# EAGLE schematic RP2350 (EAGLE 9.6.2)
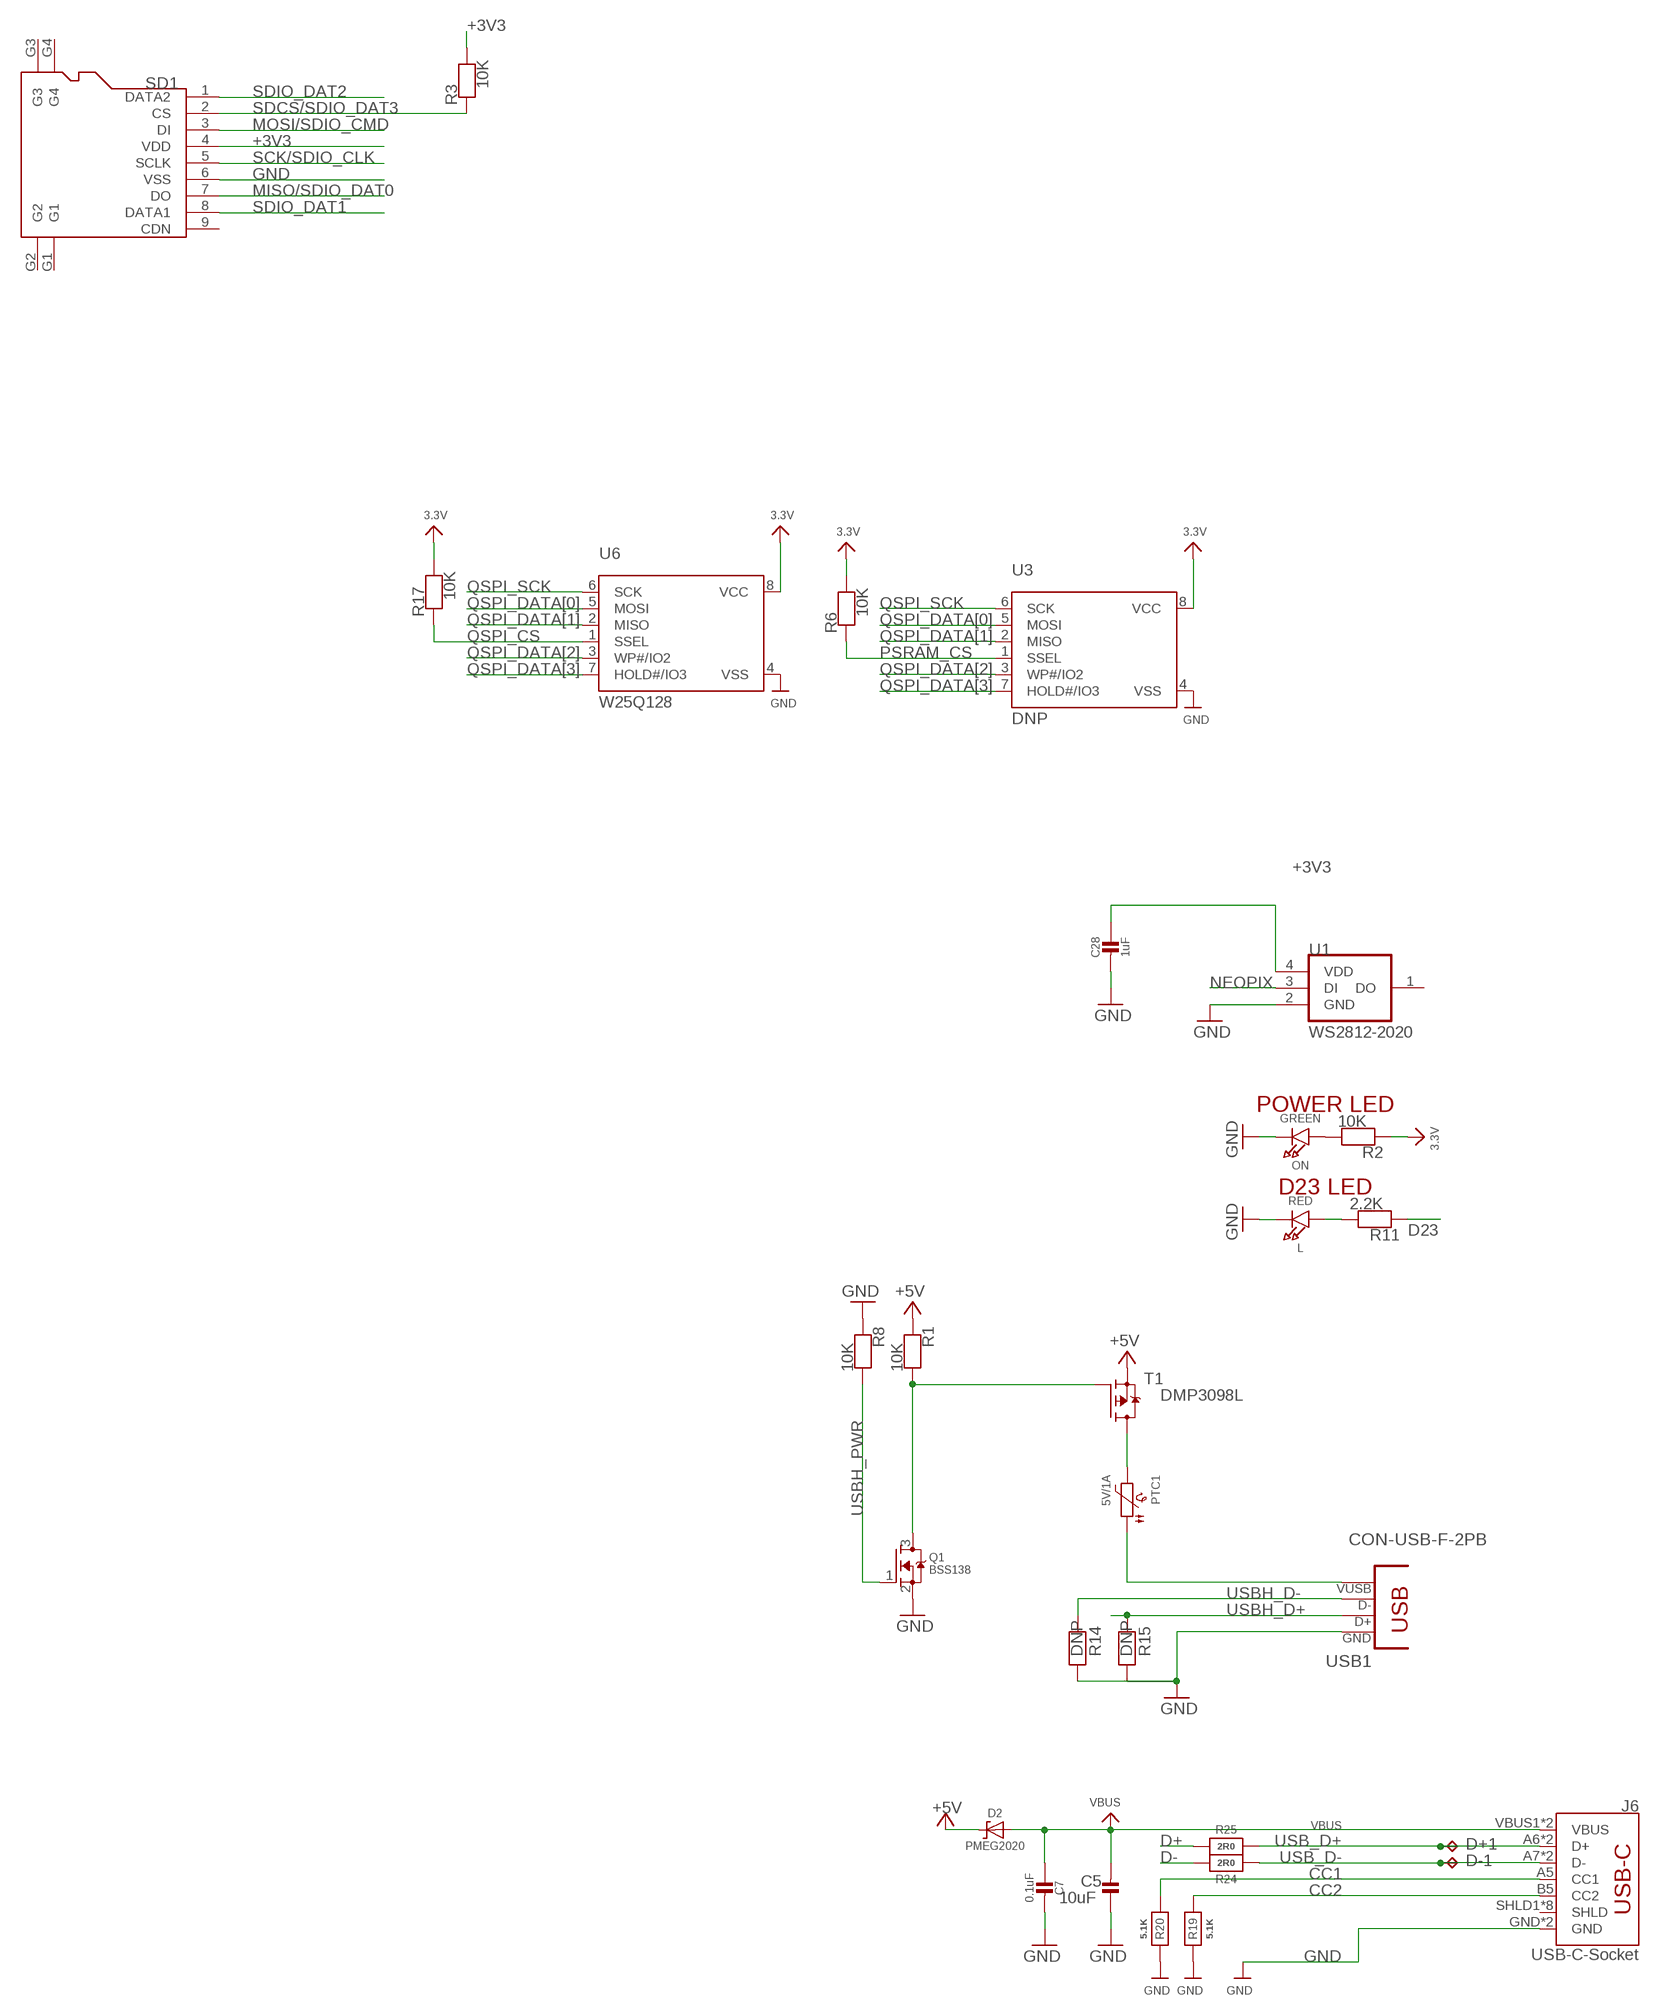
[diagram p0: schematic, sheet 1, part 1 of 2]
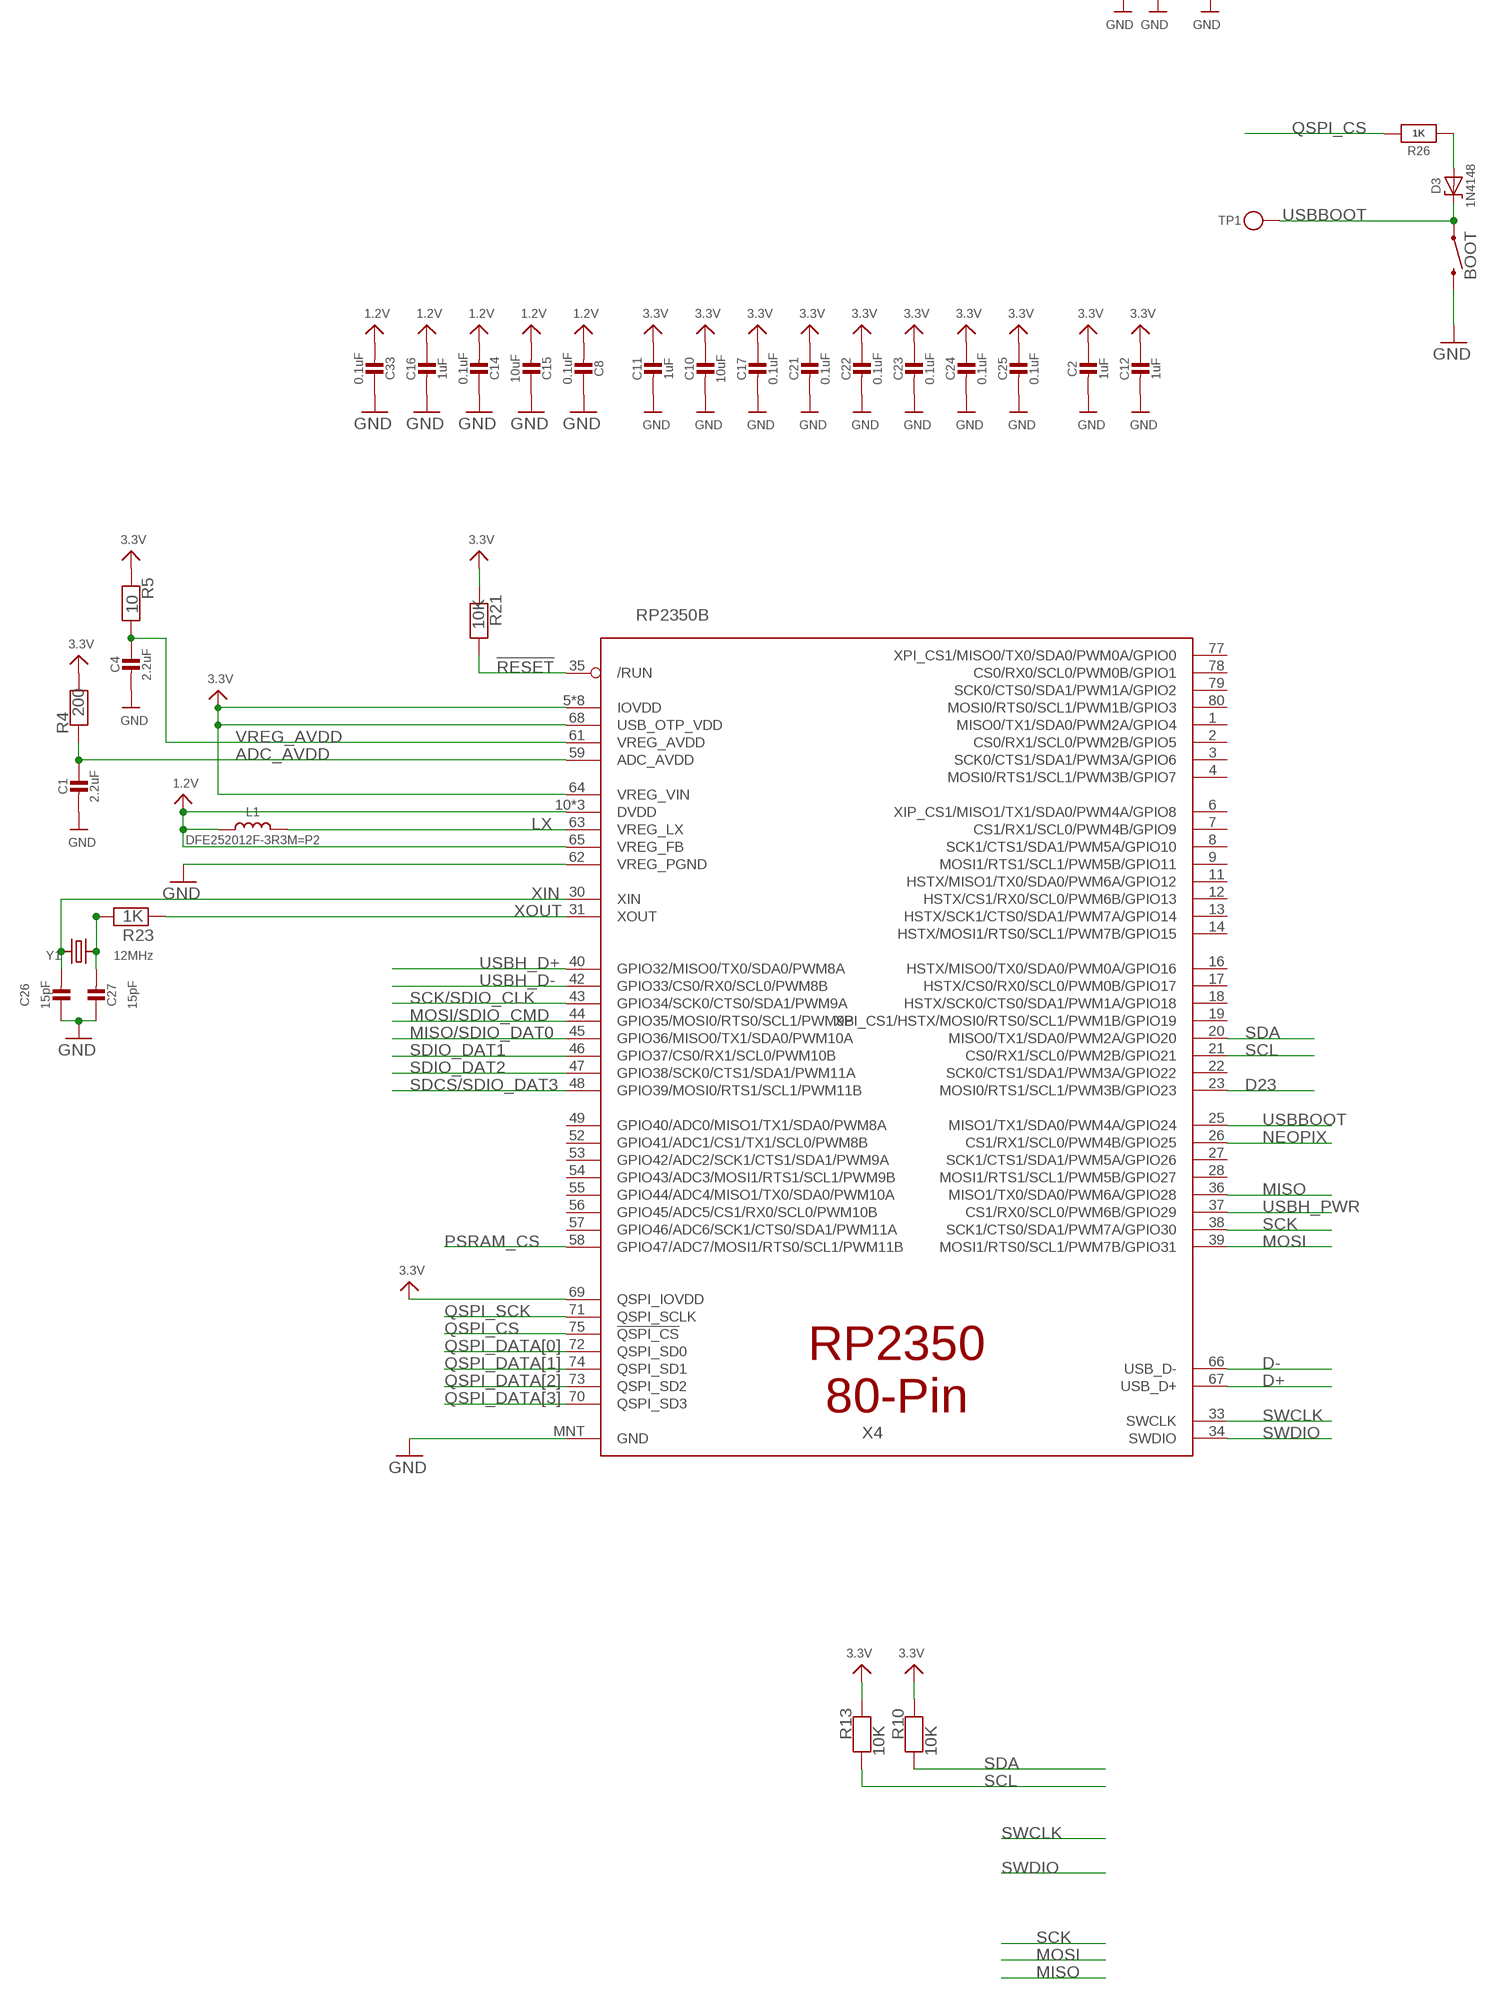
[diagram p1: schematic, sheet 1, part 2 of 2]

## Parts
BOOT  MOMENTARY-SWITCH-SPST-SMD-6.0X3.5MM  [TACTILE_SWITCH_SMD_6.0X3.5MM]
C1  2.2uF  CAP_CERAMIC0603_NO  [0603-NO]
C2  1uF  CAP_CERAMIC0603_NO  [0603-NO]
C4  2.2uF  CAP_CERAMIC0603_NO  [0603-NO]
C5  10uF  CAP_CERAMIC0805-NOOUTLINE  [0805-NO]
C7  0.1uF  CAP_CERAMIC0603_NO  [0603-NO]
C8  0.1uF  CAP_CERAMIC0603_NO  [0603-NO]
C10  10uF  CAP_CERAMIC_0603WIDE  [0603-NO_WIDE]
C11  1uF  CAP_CERAMIC0603_NO  [0603-NO]
C12  1uF  CAP_CERAMIC0603_NO  [0603-NO]
C14  0.1uF  CAP_CERAMIC0603_NO  [0603-NO]
C15  10uF  CAP_CERAMIC_0603WIDE  [0603-NO_WIDE]
C16  1uF  CAP_CERAMIC0603_NO  [0603-NO]
C17  0.1uF  CAP_CERAMIC0603_NO  [0603-NO]
C21  0.1uF  CAP_CERAMIC0603_NO  [0603-NO]
C22  0.1uF  CAP_CERAMIC0603_NO  [0603-NO]
C23  0.1uF  CAP_CERAMIC0603_NO  [0603-NO]
C24  0.1uF  CAP_CERAMIC0603_NO  [0603-NO]
C25  0.1uF  CAP_CERAMIC0603_NO  [0603-NO]
C26  15pF  CAP_CERAMIC0603_NO  [0603-NO]
C27  15pF  CAP_CERAMIC0603_NO  [0603-NO]
C28  1uF  CAP_CERAMIC0603_NO  [0603-NO]
C33  0.1uF  CAP_CERAMIC0603_NO  [0603-NO]
D2  PMEG2020  DIODE-SCHOTTKYSOD-323  [SOD-323]
D3  1N4148  DIODE-SCHOTTKYSOD-323  [SOD-323]
D+1  TPB1,27  [B1,27]
D-1  TPB1,27  [B1,27]
J6  USB-C-Socket  USB_C16PIN  [USB-C-16P]
L  RED  LED0603_NOOUTLINE  [CHIPLED_0603_NOOUTLINE]
L1  DFE252012F-3R3M=P2  INDUCTOR  [INDUCTOR_1007]
ON  GREEN  LED0603_NOOUTLINE  [CHIPLED_0603_NOOUTLINE]
PTC1  5V/1A  PTC_0805  [0805-NO]
Q1  BSS138  MOSFET-NWIDE  [SOT23-WIDE]
R1  10K  RESISTOR_0603_NOOUT  [0603-NO]
R2  10K  RESISTOR_0603_NOOUT  [0603-NO]
R3  10K  RESISTOR_0603_NOOUT  [0603-NO]
R4  200  RESISTOR_0603_NOOUT  [0603-NO]
R5  10  RESISTOR_0603_NOOUT  [0603-NO]
R6  10K  RESISTOR_0603_NOOUT  [0603-NO]
R8  10K  RESISTOR_0603_NOOUT  [0603-NO]
R10  10K  RESISTOR_0603_NOOUT  [0603-NO]
R11  2.2K  RESISTOR_0603_NOOUT  [0603-NO]
R13  10K  RESISTOR_0603_NOOUT  [0603-NO]
R14  DNP  RESISTOR_0603_NOOUT  [0603-NO]
R15  DNP  RESISTOR_0603_NOOUT  [0603-NO]
R17  10K  RESISTOR_0603_NOOUT  [0603-NO]
R19  5.1K  RESISTOR_0603_NOOUT  [0603-NO]
R20  5.1K  RESISTOR_0603_NOOUT  [0603-NO]
R21  10K  RESISTOR_0603_NOOUT  [0603-NO]
R23  1K  RESISTOR_0603_NOOUT  [0603-NO]
R24  2R0  RESISTOR_0603_NOOUT  [0603-NO]
R25  2R0  RESISTOR_0603_NOOUT  [0603-NO]
R26  1K  RESISTOR_0603_NOOUT  [0603-NO]
SD1  HOLDER-MICROSD-9P  [9P-SMD-W/-RING]
T1  DMP3098L  MOSFET-PWIDE  [SOT23-WIDE]
TP1  TESTPOINTROUND1.5MMNO  [TESTPOINT_ROUND_1.5MM_NO]
U1  WS2812-2020  [LED_WS2812-2020]
U3  DNP  SPIFLASH_8PIN208MIL  [SOIC8_208MIL]
U6  W25Q128  SPIFLASH_8PIN208MIL  [SOIC8_208MIL]
USB1  CON-USB-F-2PB  [CONN_USB_A_F]
X4  RP2350B  [QFN80]
Y1  12MHz  CRYSTAL2.5X2.0  [CRYSTAL_2.5X2]

## Nets
1.2V: C8.2 C14.2 C15.2 C16.1 C33.2 L1.P$1 X4.10(DVDD) X4.32(DVDD) X4.51(DVDD) X4.65(VREG_FB)
!RESET: R21.2 X4.35(/RUN)
+3V3: C2.1 C10.1 C11.1 C12.1 C17.1 C21.1 C22.1 C23.1 C24.1 C25.1 C28.1 R2.1 R3.2 R4.2 R5.1 R6.2 R10.1 R13.1 R17.2 R21.1 SD1.4(VDD) U1.4(VDD) U3.8(VCC) U6.8(VCC) X4.5(IOVDD) X4.15(IOVDD) X4.24(IOVDD) X4.29(IOVDD) X4.41(IOVDD) X4.50(IOVDD) X4.60(IOVDD) X4.64(VREG_VIN) X4.68(USB_OTP_VDD) X4.69(QSPI_IOVDD) X4.76(IOVDD) ; supply symbol labelled 3.3V
+5V [HIGHPOWER]: D2.C R1.1 T1.2(S)
ADC_AVDD: C1.1 R4.1 X4.59(ADC_AVDD)
CC1: J6.A5(CC1) R20.2
CC2: J6.B5(CC2) R19.2
D23: R11.1 X4.23(MOSI0/RTS1/SCL1/PWM3B/GPIO23)
D+: R25.2 X4.67(USB_D+)
D-: R24.2 X4.66(USB_D-)
GND: BOOT.2 C1.2 C2.2 C4.2 C5.1 C7.2 C8.1 C10.2 C11.2 C12.2 C14.1 C15.1 C16.2 C17.2 C21.2 C22.2 C23.2 C24.2 C25.2 C26.1 C27.1 C28.2 C33.1 J6.GND J6.GND2(GND) L.C ON.C Q1.2(S) R8.1 R14.1 R15.1 R19.1 R20.1 SD1.6(VSS) U1.2(GND) U3.4(VSS) U6.4(VSS) USB1.4(GND) X4.62(VREG_PGND) X4.MNT(GND)
LX: L1.P$2 X4.63(VREG_LX)
MISO: X4.36(MISO1/TX0/SDA0/PWM6A/GPIO28)
MISO/SDIO_DAT0: SD1.7(DO) X4.45(GPIO36/MISO0/TX1/SDA0/PWM10A)
MOSI: X4.39(MOSI1/RTS0/SCL1/PWM7B/GPIO31)
MOSI/SDIO_CMD: SD1.3(DI) X4.44(GPIO35/MOSI0/RTS0/SCL1/PWM9B)
N$1: L.A R11.2
N$2: ON.A R2.2
N$3: PTC1.1 USB1.1(VUSB)
N$4: PTC1.2 T1.3(D)
N$5: Q1.3(D) R1.2 T1.1(G)
N$6: D3.A R26.2
N$10: C27.2 R23.1 Y1.3
NEOPIX: U1.3(DI) X4.26(CS1/RX1/SCL0/PWM4B/GPIO25)
PSRAM_CS: R6.1 U3.1(SSEL) X4.58(GPIO47/ADC7/MOSI1/RTS0/SCL1/PWM11B)
QSPI_CS: R17.1 R26.1 U6.1(SSEL) X4.75(!QSPI_CS)
QSPI_DATA[0]: U3.5(MOSI) U6.5(MOSI) X4.72(QSPI_SD0)
QSPI_DATA[1]: U3.2(MISO) U6.2(MISO) X4.74(QSPI_SD1)
QSPI_DATA[2]: U3.3(WP#/IO2) U6.3(WP#/IO2) X4.73(QSPI_SD2)
QSPI_DATA[3]: U3.7(HOLD#/IO3) U6.7(HOLD#/IO3) X4.70(QSPI_SD3)
QSPI_SCK: U3.6(SCK) U6.6(SCK) X4.71(QSPI_SCLK)
SCK: X4.38(SCK1/CTS0/SDA1/PWM7A/GPIO30)
SCK/SDIO_CLK: SD1.5(SCLK) X4.43(GPIO34/SCK0/CTS0/SDA1/PWM9A)
SCL: R13.2 X4.21(CS0/RX1/SCL0/PWM2B/GPIO21)
SDA: R10.2 X4.20(MISO0/TX1/SDA0/PWM2A/GPIO20)
SDCS/SDIO_DAT3: R3.1 SD1.2(CS) X4.48(GPIO39/MOSI0/RTS1/SCL1/PWM11B)
SDIO_DAT1: SD1.8(DATA1) X4.46(GPIO37/CS0/RX1/SCL0/PWM10B)
SDIO_DAT2: SD1.1(DATA2) X4.47(GPIO38/SCK0/CTS1/SDA1/PWM11A)
SWCLK: X4.33(SWCLK)
SWDIO: X4.34(SWDIO)
USB_D+: D+1.TP J6.A6(D+) J6.B6(D+) R25.1
USB_D-: D-1.TP J6.A7(D-) J6.B7(D-) R24.1
USBBOOT: BOOT.1 D3.C TP1.P$1 X4.25(MISO1/TX1/SDA0/PWM4A/GPIO24)
USBH_D+: R15.2 USB1.3(D+) X4.40(GPIO32/MISO0/TX0/SDA0/PWM8A)
USBH_D-: R14.2 USB1.2(D-) X4.42(GPIO33/CS0/RX0/SCL0/PWM8B)
USBH_PWR: Q1.1(G) R8.2 X4.37(CS1/RX0/SCL0/PWM6B/GPIO29)
VBUS [HIGHPOWER]: C5.2 C7.1 D2.A J6.VBUS1(VBUS) J6.VBUS2(VBUS)
VREG_AVDD: C4.1 R5.2 X4.61(VREG_AVDD)
XIN: C26.2 X4.30(XIN) Y1.1
XOUT: R23.2 X4.31(XOUT)
Unconnected: J6.SHLD1(SHLD) J6.SHLD2(SHLD) J6.SHLD3(SHLD) J6.SHLD4(SHLD) J6.SHLD5(SHLD) J6.SHLD6(SHLD) J6.SHLD7(SHLD) J6.SHLD8(SHLD) SD1.9(CDN) SD1.G1 SD1.G2 SD1.G3 SD1.G4 U1.1(DO) USB1.B1(BODY) USB1.B2(BODY) X4.1(MISO0/TX1/SDA0/PWM2A/GPIO4) X4.2(CS0/RX1/SCL0/PWM2B/GPIO5) X4.3(SCK0/CTS1/SDA1/PWM3A/GPIO6) X4.4(MOSI0/RTS1/SCL1/PWM3B/GPIO7) X4.6(XIP_CS1/MISO1/TX1/SDA0/PWM4A/GPIO8) X4.7(CS1/RX1/SCL0/PWM4B/GPIO9) X4.8(SCK1/CTS1/SDA1/PWM5A/GPIO10) X4.9(MOSI1/RTS1/SCL1/PWM5B/GPIO11) X4.11(HSTX/MISO1/TX0/SDA0/PWM6A/GPIO12) X4.12(HSTX/CS1/RX0/SCL0/PWM6B/GPIO13) X4.13(HSTX/SCK1/CTS0/SDA1/PWM7A/GPIO14) X4.14(HSTX/MOSI1/RTS0/SCL1/PWM7B/GPIO15) X4.16(HSTX/MISO0/TX0/SDA0/PWM0A/GPIO16) X4.17(HSTX/CS0/RX0/SCL0/PWM0B/GPIO17) X4.18(HSTX/SCK0/CTS0/SDA1/PWM1A/GPIO18) X4.19(XPI_CS1/HSTX/MOSI0/RTS0/SCL1/PWM1B/GPIO19) X4.22(SCK0/CTS1/SDA1/PWM3A/GPIO22) X4.27(SCK1/CTS1/SDA1/PWM5A/GPIO26) X4.28(MOSI1/RTS1/SCL1/PWM5B/GPIO27) X4.49(GPIO40/ADC0/MISO1/TX1/SDA0/PWM8A) X4.52(GPIO41/ADC1/CS1/TX1/SCL0/PWM8B) X4.53(GPIO42/ADC2/SCK1/CTS1/SDA1/PWM9A) X4.54(GPIO43/ADC3/MOSI1/RTS1/SCL1/PWM9B) X4.55(GPIO44/ADC4/MISO1/TX0/SDA0/PWM10A) X4.56(GPIO45/ADC5/CS1/RX0/SCL0/PWM10B) X4.57(GPIO46/ADC6/SCK1/CTS0/SDA1/PWM11A) X4.77(XPI_CS1/MISO0/TX0/SDA0/PWM0A/GPIO0) X4.78(CS0/RX0/SCL0/PWM0B/GPIO1) X4.79(SCK0/CTS0/SDA1/PWM1A/GPIO2) X4.80(MOSI0/RTS0/SCL1/PWM1B/GPIO3)

## Notes on the sheet
- POWER LED
- D23 LED

## Library data of the parts
BOOT = SparkFun-Switches:MOMENTARY-SWITCH-SPST: Momentary Switch (Pushbutton) - SPST Normally-open (NO) SPST momentary switches (buttons, pushbuttons). Variants PTH-12MM - 12mm square, through-hole Momentary Pushbutton Switch - 12mm Square <https://www.sparkfun.com/products/9190> (COM-09190) PTH-6.0MM, PTH-6.0MM-KIT - 6.0mm square, through-hole Mini Pushbutton Switch <https://www.sparkfun.com/products/97> (COM-00097) KIT package intended for soldering kit's - only one side of pads' copper is exposed. PTH-RIGHT-ANGLE-KIT - Right-angle, through-hole Right Angle Tactile Button <https://www.sparkfun.com/products/10791> - Used on SparkFun BigTime Watch Kit <https://www.sparkfun.com/products/11734> SMD-12MM - 12mm square, surface-mount Tactile Button - SMD (12mm) <https://www.sparkfun.com/products/12993> (COM-12993) Used on SparkFun PicoBoard <https://www.sparkfun.com/products/11888> SMD-4.5MM - 4.5mm Square Trackball Switch Used on SparkFun Blackberry Trackballer Breakout <https://www.sparkfun.com/products/13169> SMD-4.6MMX2.8MM - 4.60mm x 2.80mm, surface mount Used on SparkFun Pro Micro - RP2040 <https://www.sparkfun.com/products/17717> SMD-5.2MM, SMD-5.2-REDUNDANT - 5.2mm square, surface-mount Mini Pushbutton Switch - SMD <https://www.sparkfun.com/products/8720> (COM-08720) Used on Arduino Pro Mini <https://www.sparkfun.com/products/11114> REDUNDANT package connects both switch circuits together SMD-6.0X3.5MM - 6.0 x 3.5mm, surface mount Momentary Reset Switch SMD <https://www.sparkfun.com/products/8229> (COM-08229) SMD-6.2MM-TALL - 6.2mm square, surface mount Tactile Button - SMD (6mm) <https://www.sparkfun.com/products/12992> Used on SparkFun Digital Sandbox <https://www.sparkfun.com/products/12651> SMD-RIGHT-ANGLE - Right-angle, surface mount Used on SparkFun Block for Intel® Edison - Arduino <https://www.sparkfun.com/products/13036>; PROD_ID: SWCH-14278; SF_SKU: COM-08229
C1 C2 C4 C5 C7 C8 C10-C12 C14-C17 C21-C28 C33 = microbuilder:CAP_CERAMIC: Ceramic Capacitors For new designs, use the packages preceded by an '_' character since they are more reliable: The following footprints should be used on most boards: _0402 - Standard footprint for regular board layouts _0603 - Standard footprint for regular board layouts _0805 - Standard footprint for regular board layouts _1206 - Standard footprint for regular board layouts For extremely tight-pitch boards where space is at a premium, the following 'micro-pitch' footprints can be used (smaller pads, no silkscreen outline, etc.): _0402MP - Micro-pitch footprint for very dense/compact boards _0603MP - Micro-pitch footprint for very dense/compact boards _0805MP - Micro-pitch footprint for very dense/compact boards _1206MP - Micro-pitch footprint for very dense/compact boards
D2 D3 = microbuilder:DIODE-SCHOTTKY
D+1 D-1 = testpad:TP: Test pad
J6 = SparkFun-Connectors:USB_C: USB Type C 16Pin Connector Super Speed pins not available on the 16-pin purely SMD connector so this part is best for USB 2.0 implementations. D1 and D2 are tied together enabling D+/- no matter which way the cable is plugged into the connector. The two channel configuration pins (CC1/2) are exposed. These are normally connected to ground via 5.1k resistors but can be reconfigured for high current/high power applications.; PROD_ID: CONN-14122
L ON = microbuilder:LED: LED 0603 - 0603 Surface Mount Package 2mA: Green LED - Low Power (3.9mcd, 2ma, 1.7Vf) - Digikey: 475-2709-2-ND Orange LED - Low Power (9.8mcd, 2ma, 1.8Vf) - Digikey: 475-1194-2-ND Red LED - Low Power (5mcd, 2ma, 1.8Vf) - Digikey: 475-1195-2-ND Yellow LED - Low Power (7mcd, 2ma, 1.8Vf) - Digikey: 475-1196-2-ND 5mA: Blue LED - Low Power (17mcd, 5ma, 2.9Vf) - Digikey: LNJ937W8CRACT-ND 0805 - 0805 Surface Mount Package 2mA: Red LED (8.8mcd, 2mA, 1.8Vf, Clear) - Low Power [Digikey: 475-2510-1-ND] Green LED (5mcd, 2mA, 1.8Vf, Clear) - Low Power [Digikey: 475-2730-1-ND] Yellow LED (11.3mcd, 2mA, 1.8Vf, Clear) - Low Power [Digikey: 475-2555-1-ND] 20mA: Red LED (104mcd, 20mA, Diffused) - LS R976 [Digikey: 475-1278-6-ND] Red LED (12mcd, 20mA, 2.0Vf, Clear) - APT2012EC [Digikey: 754-1128-1-ND] Green LED (15mcd, 20mA, 2.2Vf, Clear) - APT2012GC [Digikey: 754-1131-1-ND] Orange LED (160mcd, 20mA, 2.1Vf, Clear) - APT2012SECK [Digikey: 754-1130-1-ND] 1206 - 1206 Surface Mount Package Green LED (26mcd, 20mA, Diffused) - LG N971 [Digikey: 475-1407-6-ND] Red LED (15mcd, 20mA, Diffused) - LH N974 [Digikey: 475-1416-6-ND] Cree - Cree High-Power Surface Mount LEDs XPEBWT-L1-0000-00D50 - White 111lm 350mA 2.9Vf 6200K 110° XTEAWT-00-0000-00000LEE3 - White 114lm 350mA 2.85Vf 5000K 115° Everlight - Everlight 45-21 Series Surface Mount LEDs 45-21/QK2C-B2832AC2CB2/2T - Warm White 2000mcd 20mA 3.25Vf 3050K 120° 45-21/LK2C-B38452C4CB2/2T - Nuetral White 2000mcd 20mA 3.25Vf 4150K 120° 45-21/LK2C-B50634C6CB2/2T - Cold White 2200mcd 20mA 3.25Vf 5650K 120° PLCC2 Reverse Mount LS T77K-J1L2-1-0-2-R18-Z - Red 11.25mcd 2mA 1.8Vf 630nm 120° LO T77K-L1M2-24-Z - Orange 19.6mcd 2mA 1.8Vf 606nm 120° LY T77K-K2M1-26-Z - Yellow 15.7mcd 2mA 1.8Vf 587nm 120°; ROT: 270
L1 = microbuilder:INDUCTOR: Inductors 0603: 10nH Ceramic Inductor - microwire antenna/RF (Digikey: 712-1434-2-ND) 0805: 560nH Ceramic Inductor - RF (Digikey: 553-1047-1-ND) 270nH Ceramic Inductor - Q = 40@250MHz, +-5%, 1 Ohm DC Resistance (Digikey: 535-10506-2-ND) 1007 (2518 Metric) SMT: 10µH 10% 250mOhm 820mA 1007 Inductor (Digikey: 587-2189-1-ND) 22µH 10% 500mOhm 580mA 1007 Inductor (Digikey: 587-2190-1-ND) 47µH 10% 950mOhm 420mA 1007 Inductor (Digikey: 587-2191-1-ND) 47µH 5% 100mOhm 1A 1008 Inductor (Digikey: 732-1816-1-ND) 5.0x5.0mm (Taiyo Yuden NR5040 Series) 6.8µH 20% 2.3A 64mOhm Inductor (Digikey: 587-2374-2-ND) 5.0x5.0mm (TDK VLC5045 Series) 4.7µH 20% 3.3A 34mOhm Inductor (Digikey: 445-6526-1-ND) 6.8µH 20% 2.7A 46mOhm Inductor (Digikey: 445-6527-1-ND) 6.0x6.0mm (TDK VLC6045 Series) 4.7µH 20% 3.8A 27mOhm Inductor (Digikey: 445-6538-2-ND) 6.8µH 20% 3A 41mOhm Inductor (Digikey: 445-6540-1-ND) 6.2µH 30% 2.2A 45mOhm Inductor (Digikey: SRR5028-6R2YCT-ND) - Not TDK VLC6045 but footprint should match 6.0x6.0mm (TDK SLF6045 Series) 6.8uH 30% 2A 33mOhm Inductor (Digikey: 445-4572-1-ND, Mouser: 810-SLF645T6R8N2R0PF) 6.0x6.0mm (Sumida CDRH5D28 Series) 6.2uH 30% 1.8A 45mOhm Inductor (Digikey: 308-1542-1-ND) Taiyo Yuden NR3015T2R2M - 2.2uH 20% 1.5A (Digikey: 587-1648-2-ND, Mouser: 963-NR3015T2R2M) - Used with TI TPS62172 CoilCraft RFID Transponder Coil - MA5532-AE (For use with AS3935 Lightning Sensor) Taiyo Yuden NRH2412T2R2MNGH - 2.2uH 20% 1AA (Digikey: 587-3443-1-ND) - Used with TI LM3671 Vishay IHLP 1.0uH Molded Inductor - 24mOhm DCR, 5A, +/-20%, -55°C-125°C (Digikey: 541-1319-1-ND)
PTC1 = microbuilder:PTC: PTC (Resettable Fuse) 1206 Package 250mA PTC (16V Max, Time-to-Trip: 0.08s) - Digikey: F2110CT-ND 1210 Package 100mA PTC (30V Max, Time-to-Trip: 0.6s) - Digikey: MF-USMF010-2CT-ND 1812 Package 750mA PTC (24V Max, Time-to-Trip: 0.2s) - Digikey: MF-MSMF075/24-2CT-ND
Q1 = microbuilder:MOSFET-N: N-Channel Mosfet LEGEND VDS: Voltage Drain-Source ID: Drain Current RDS(ON): Drain-Source On-State Resistance VGS(TH): Gate-Source Threshold Voltage CISS: Drain-Source Input Capacitance SOT-23 Name VDS ID RDS(ON) VGS(TH) CISS Order Number 2N7002E 60V 260mA 2.5 Ohm 2.5V @ 250uA 26.7pF @ 25V 2N7002ET1GOSTR-ND BSH103 30V 850mA 400 mOhm 400mV @ 1mA 83pF @ 24V BSH103,235-ND BSS138 60V 320mA 1.6 Ohm 1.5V @ 250uA 50pF @ 10V Mouser: 771-BSS138PW115 DMN2075U-7 20V 4.2A 38 mOhm 1V @ 250 uA 594.3pF @ 10V DMN2075U-7DICT-ND * BSS138 good choice for I2C level-shifting POWERPAK 1212-8 Name VDS ID RDS(ON) VGS(TH) CISS Order Number Si7308DN 60V 6A 58 mOhm 3V @ 250uA 665pF @ 15V SI7308DN-T1-E3CT-ND
R1-R6 R8 R10 R11 R13-R15 R17 R19-R21 R23-R26 = microbuilder:RESISTOR: Resistors For new designs, use the packages preceded by an '_' character since they are more reliable: The following footprints should be used on most boards: _0402 - Standard footprint for regular board layouts _0603 - Standard footprint for regular board layouts _0805 - Standard footprint for regular board layouts _1206 - Standard footprint for regular board layouts For extremely tight-pitch boards where space is at a premium, the following 'micro-pitch' footprints can be used (smaller pads, no silkscreen outline, etc.): _0402MP - Micro-pitch footprint for very dense/compact boards _0603MP - Micro-pitch footprint for very dense/compact boards _0805MP - Micro-pitch footprint for very dense/compact boards _1206MP - Micro-pitch footprint for very dense/compact boards
SD1 = Connector:HOLDER-MICROSD-9P
T1 = microbuilder:MOSFET-P: P-Channel Mosfet LEGEND VDS: Voltage Drain-Source ID: Drain Current RDS(ON): Drain-Source On-State Resistance VGS(TH): Gate-Source Threshold Voltage CISS: Drain-Source Input Capacitance SOT-23 Name VDS ID RDS(ON) VGS(TH) CISS Order Number IRLML5103 30V 760mA 600 mOhm -- 75pF @ 25V Digikey: IRLML5103PBFCT-ND IRLML6401 12V 4.3A 50 mOhm 950mV @ 250µA 830pF @ 10V Digikey: IRLML6401PBFTR-ND NTR0202PL 20V 400mA 800 mOhm 2.3V @ 250uA 70pF @ 5V Digikey: NTR0202PLT1GOSTR-ND NTR4101PT1G 20V 1.8A 85 mOhm 1.2V @ 250uA 675pF @ 10V Digikey: NTR4101PT1GOSCT-ND DMP2004K 20V 600mA 900 mOhm 1V @ 250uA 175pF @ 16V Digikey: DMP2004KDICT-ND PMV65XP 20V 3.9A 76 mOhm 950mV @ 1mA 725pF @ 20V Digikey: 568-2358-2-ND TO-252 Name VDS ID RDS(ON) VGS(TH) CISS Order Number AOD417 30V 25A 34 mOhm 3V @ 250µA 920pF @ 15V Digikey: 785-1106-2-ND PowerPak Name VDS ID RDS(ON) VGS(TH) CISS Order Number AON7401 30V 12A 14 mOhm 3V @ 250µA 2600pF @ 15V Digikey: 785-1302-1-ND
TP1 = microbuilder:TESTPOINT: Test Point Various test points for characterisation and PCB testing TESTPOINT_SMT - Compact Surface Mount Test Point [Digikey: 5016KTR-ND]
U1 = WS2812-2020:WS2812-2020: Check availability <https://pricing.snapeda.com/parts/WS2812-2020/Worldsemi/view-part?ref=eda>; AVAILABILITY: Not in stock; CHECK_PRICES: https://www.snapeda.com/parts/WS2812-2020/Worldsemi/view-part/?ref=eda; DESCRIPTION: Intelligent control LED light source, SMD-4; MF: Worldsemi; MP: WS2812-2020; PACKAGE: Package; PRICE: None; SNAPEDA_LINK: https://www.snapeda.com/parts/WS2812-2020/Worldsemi/view-part/?ref=snap
U3 U6 = microbuilder:SPIFLASH_8PIN: SOIC8 SPI Flash Be careful with the size since SOIC8 flash comes in several 'widths' SOIC8 150 mil M25P16 - 16Mbit (2Mbit x 8) Serial Flash (75MHz SPI Bus), Supply: 2.7-3.6V Digikey: SOIC8 - M25P16-VMN6P-ND SOIC8 208 mil W25Q16BVSSIG - 16Mbit (2Mbit x 8) Serial Flash (104MHz SPI Bus), Supply: 2.7-3.6V Digikey: SOIC8 - W25Q16BVSSIG-ND
USB1 = dp_devices.v6:CON-USB-F-2PB: USB Female connector with 2 body pins
X4 = adafruit_micro:RP2350B
Y1 = microbuilder:CRYSTAL: Crystals HC49UP - Surface Mount Crystal 4.0MHz 18pF +/-30ppm Surface Mount Crystal [Digikey: 535-9857-1-ND] 12.0 MHz Surface Mount Crystal [Digikey: 535-9869-6-ND] 25.0 MHz Surface Mount Crystal [Digikey: 535-9078-1-ND] 2.5 x 2.0mm - MEMs SMT Crystal 16.0 MHz 10pF 20ppm 2.5 x 2.0mm Crystal [Digikey -40-85°C: 535-10923-1-ND] 3.2 x 2.5mm - MEMs SMT Crystal 12.0 MHz 8pF 15ppm 3.2 x 2.5mm Crystal [Digikey: -10-70°C: 644-1047-1-ND -40-125°C: 644-1128-1-ND] 40~85°C cheaper: 644-1173-6-ND 16.0 MHz 8pF 15ppm 3.2 x 2.5mm Crystal [Digikey: -10-70°C: 644-1049-1-ND -40-125°C: 644-1129-2-ND]-40~85°C cheaper: 644-1175-6-ND 16.0 MHz 10pF 10ppm 3.2 x 2.5mm Crystal [Digikey: 644-1100-1-ND] 27.12 MHz 18pF 30ppm 3.2 x 2.5mm Crystal [Digikey: 887-1424-1-ND] 27.12MHz 10pF 10ppm 3.2 x 2.5mm Crystal [Digikey: 887-1329-1-ND] 4.9 x 1.8mm - MEMs SMT Crystal 32.768 KHz 12.5pF 20ppm 4.9 x 1.8mm Crystal [Digikey: SE2415CT-ND] 8.0 x 3.8mm - Surface Mount Crystal 32.768kHz 12.5pF 20ppm -40°C-85°C [Digikey: 535-9166-2-ND] Cylinder 32.768KHz Cylinder Crystal (2x6mm body) [Ex. Digikey: 300-8341-2-ND]

## Net classes
0 default: width 0.178 mm, drill 0.305 mm
1 power: width 0.305 mm
3 HIGHPOWER: width 0.254 mm, drill 0.483 mm
4 LOWPOWER: width 0.254 mm